# EasyEDA schematic 1-Schematic_KANDA WEATHER.json
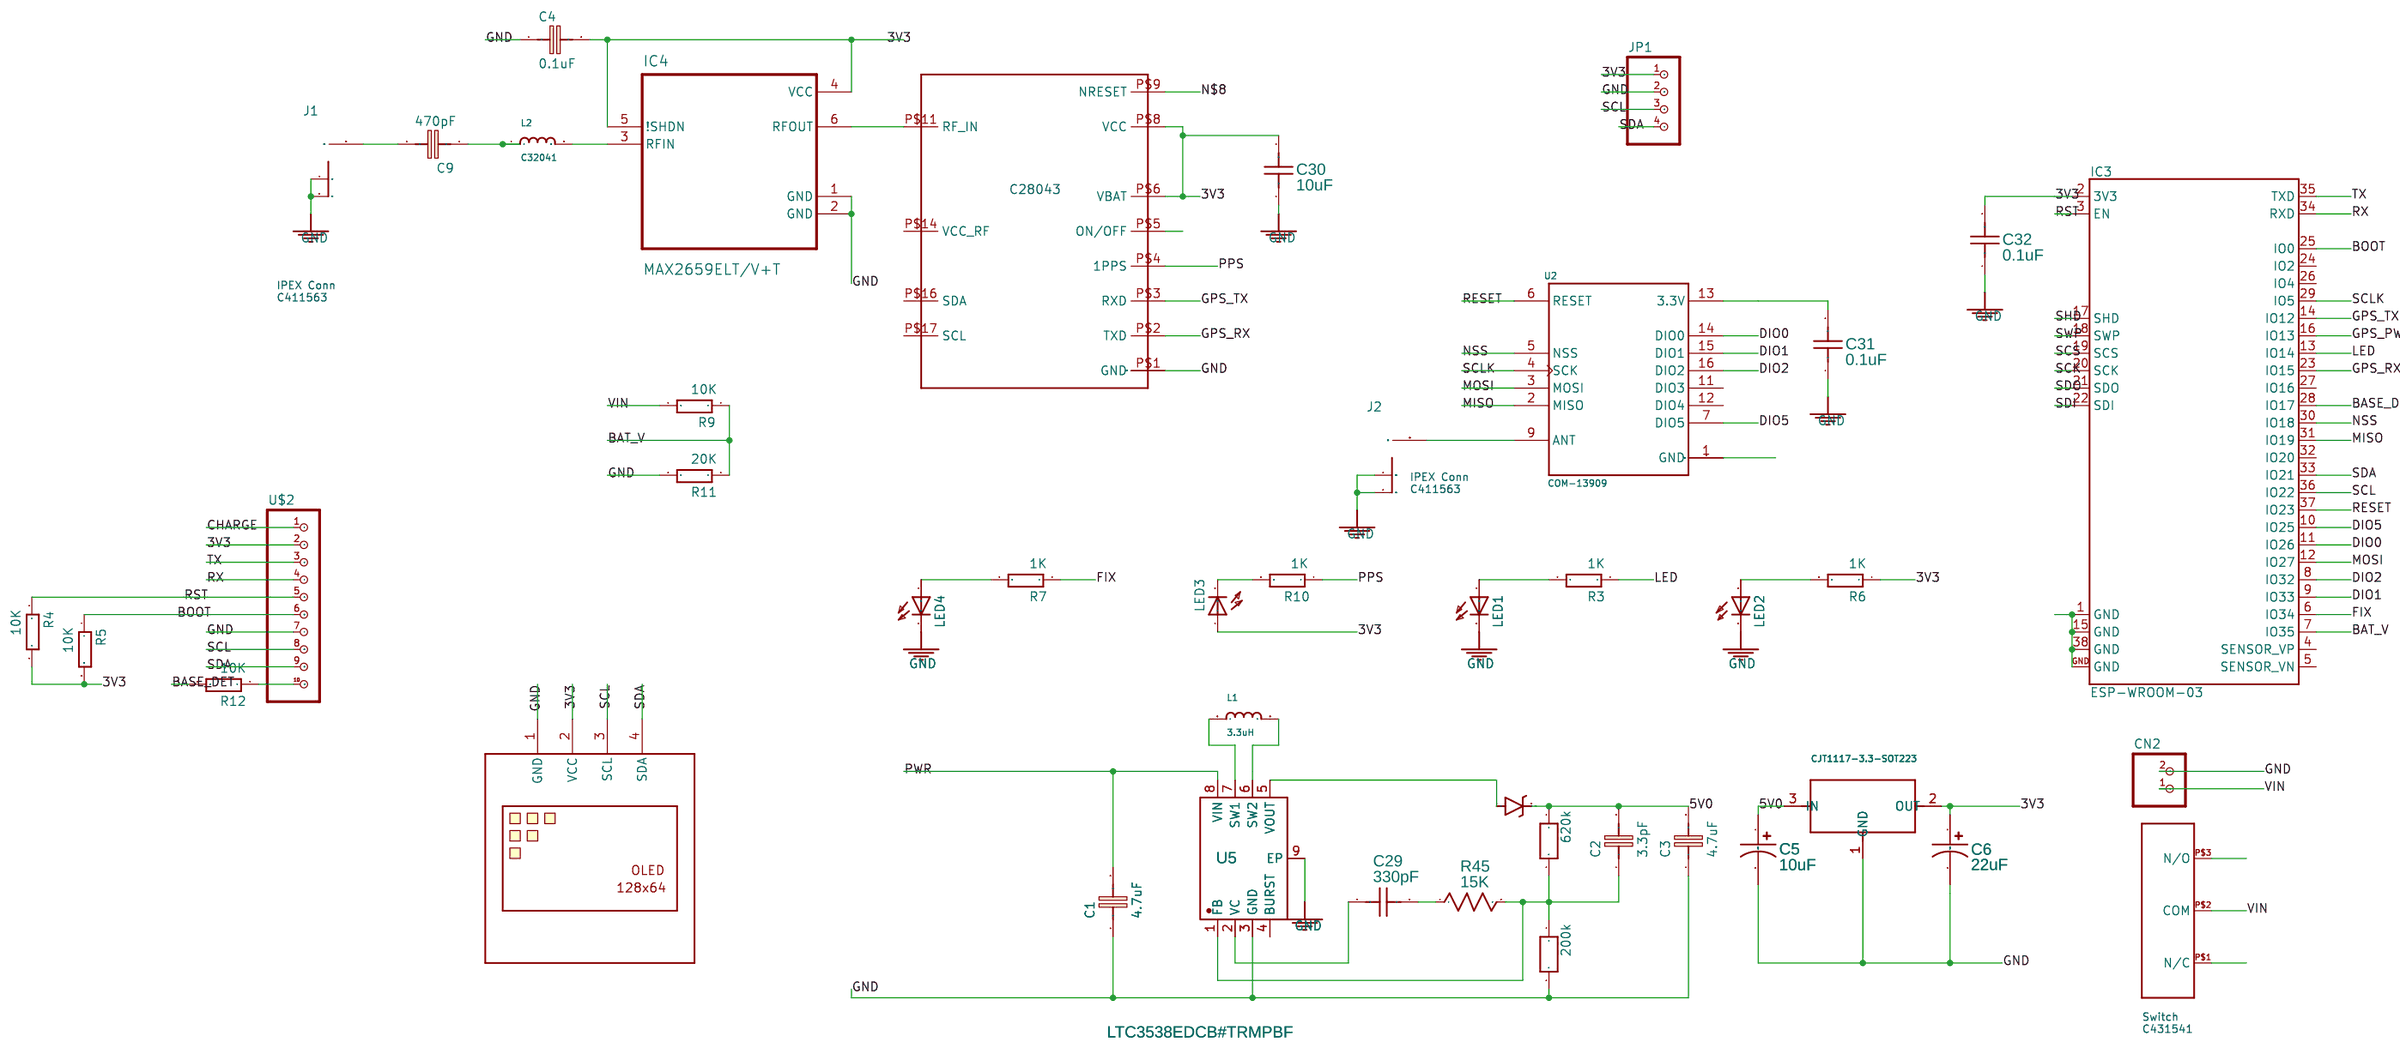
[diagram p0: schematic sheet]

## Parts
C1  4.7uF  [CAPC1608X92N]
C2  3.3pF  [CAPC1005X60N]
C3  4.7uF  [CAPC1608X92N]
C4  0.1uF  [CAPC1608X92N]
C5  10uF  [CASE-A_3216]
C6  22uF  [CASE-A_3216]
C9  470pF  [CAPC1608X92N]
C29  330pF  [C0402]
C30  10uF  [C0805]
C31  0.1uF  [C0603]
C32  0.1uF  [C0603]
CN2  JST_2PIN-THM  [JST-PH-2-THM]
D1  BA340A  [SMA-DIODE]
IC1  CJT1117-3.3-SOT223  [SOT-223]
IC3  ESP-WROOM-03  [ESP-WROOM-03]
IC4  MAX2659ELT/V+T  [SON50P150X100X80-6N]
IC54  ATGM336H  [ATGM336H]
J1  U.FL  [U.FL]
J2  U.FL  [U.FL]
JP1  HEADER-1X4ROUND  [1X04_ROUND]
L1  3.3uH  [INDUCTOR_5X5MM_NR5040_NOTHERMALS]
L2  C32041  [_0402]
LED1  LEDSML0805  [SML0805]
LED2  LEDSML0805  [SML0805]
LED3  LEDSML0805  [SML0805]
LED4  LEDSML0805  [SML0805]
R1  620k  [0603]
R2  200k  [0603]
R3  1K  [RESC1608X55N]
R4  10K  [RESC1608X55N]
R5  10K  [RESC1608X55N]
R6  1K  [RESC2012X70N]
R7  1K  [RESC1608X55N]
R9  10K  [RESC1608X55N]
R10  1K  [RESC1608X55N]
R11  20K  [RESC1608X55N]
R12  10K  [RESC1608X55N]
R45  15K  [R0603]
S1  SMD-SWITCH  [SMD-SWITCH]
U2  COM-13909  [MOD_COM-13909]
U5  LTC3538EDCB#TRMPBF  [DFN-8_L3.0-W2.0-P0.45-BL-EP]
U$1  DISPLAY-OLED-128X64-I2C  [DISPLAY-OLED-128X64-I2C]
U$2  HEADER-1X10ROUND  [1X10_ROUND]

## Library data of the parts
C1 = -: Package Display: No
C5 C6 = C_Tan_SMD_A_US: Contributor: LCEDA_Lib
C29 = C_0402_US: Contributor: LCEDA_Lib
C30 = C_0805_US: Contributor: LCEDA_Lib
C31 C32 = C_0603_US: Contributor: LCEDA_Lib
R45 = R_0603_US: Contributor: LCEDA_Lib
U5 = LTC3538EDCB#TRMPBF: Supplier: LCSC; Supplier Part: C684931; Manufacturer: Analog Devices; Contributor: LCSC; JLCPCB Part Class: Extended Part

## Nets
3V3: C4.2 C6.1 C30.2 C32.2 IC1.2(OUT) IC3.2(3V3) IC4.4(VCC) IC4.5(!SHDN) IC54.P$6(VBAT) IC54.P$8(VCC) JP1.1 LED3.A R4.2 R5.2 R6.1 U$1.2(VCC) U$2.2
5V0: C2.2 C3.2 C5.1 D1.C IC1.3(IN) R1.1
GND: C1.1 C3.1 C4.1 C5.2 C6.2 C30.1 C31.1 C32.1 CN2.2(1) IC1.1(GND) IC4.1(GND) IC4.2(GND) IC54.P$1(GND) IC54.P$10(GND) IC54.P$12(GND) J1.1(GND) J1.2(GND) J2.1(GND) J2.2(GND) JP1.2 LED1.C LED2.C LED4.C R2.2 R11.2 U5.3(GND) U5.9(EP) U$1.1(GND) U$2.7
VIN: CN2.1(2) R9.2 S1.P$2(COM)
BASE_DET: IC3.28(IO17) R12.2
BAT_V: IC3.7(IO35) R9.1 R11.1
BOOT: IC3.25(IO0) R5.1 U$2.6
CHARGE: U$2.1
DIO0: IC3.11(IO26) U2.14(DIO0)
DIO1: IC3.9(IO33) U2.15(DIO1)
DIO2: IC3.8(IO32) U2.16(DIO2)
DIO5: IC3.10(IO25) U2.7(DIO5)
FIX: IC3.6(IO34) R7.1
GPS_PWR: IC3.16(IO13)
GPS_RX: IC3.23(IO15) IC54.P$2(TXD)
GPS_TX: IC3.14(IO12) IC54.P$3(RXD)
LED: IC3.13(IO14) R3.1
MISO: IC3.31(IO19) U2.2(MISO)
MOSI: IC3.12(IO27) U2.3(MOSI)
N$8: IC54.P$9(NRESET)
NSS: IC3.30(IO18) U2.5(NSS)
PPS: IC54.P$4(1PPS) R10.1
PWR: C1.2 U5.8(VIN)
RESET: IC3.37(IO23) U2.6(RESET)
RST: IC3.3(EN) R4.1 U$2.5
RX: IC3.34(RXD) U$2.4
SCK: IC3.20(SCK)
SCL: IC3.36(IO22) JP1.3 U$1.3(SCL) U$2.8
SCLK: IC3.29(IO5) U2.4(SCK)
SCS: IC3.19(SCS)
SDA: IC3.33(IO21) JP1.4 U$1.4(SDA) U$2.9
SDI: IC3.22(SDI)
SDO: IC3.21(SDO)
SHD: IC3.17(SHD)
SWP: IC3.18(SWP)
TX: IC3.35(TXD) U$2.3
Net-(C2-1): C2.1 R1.2 R2.1 R45.2 U5.1(FB)
Net-(C9-1): C9.1 L2.1
Net-(C9-2): C9.2 J1.FEED(SIGNAL)
Net-(C29-1): C29.1 U5.2(VC)
Net-(C29-2): C29.2 R45.1
Net-(C31-2): C31.2 U2.13(3.3V)
Net-(D1-A): D1.A U5.5(VOUT)
Net-(IC3-1): IC3.1(GND) IC3.15(GND) IC3.38(GND) IC3.GND
Net-(IC4-3): IC4.3(RFIN) L2.2
Net-(IC4-6): IC4.6(RFOUT) IC54.P$11(RF_IN)
Net-(J2-FEED): J2.FEED(SIGNAL) U2.9(ANT)
Net-(L1-P$1): L1.P$1(1) U5.7(SW1)
Net-(L1-P$2): L1.P$2(2) U5.6(SW2)
Net-(LED1-A): LED1.A R3.2
Net-(LED2-A): LED2.A R6.2
Net-(LED3-C): LED3.C R10.2
Net-(LED4-A): LED4.A R7.2
Net-(R12-1): R12.1 U$2.10
Net-(U2-1): U2.1(GND) U2.8(GND) U2.10(GND)

Not connected (* = marked no-connect by the designer): IC3 4(SENSOR_VP) 5(SENSOR_VN) 24(IO2) 26(IO4) 27(IO16) 32(IO20); IC54 P$5(ON/OFF) P$14(VCC_RF) P$16(SDA) P$17(SCL); S1 P$1(N/C) P$3(N/O); U2 11(DIO3) 12(DIO4); U5 4(BURST)

## Notes on the sheet
- C28043
- IPEX Conn
  C411563
- IPEX Conn
  C411563
- Switch
  C431541
